# EasyEDA schematic Schematic_IOT_Mertz.json
TITLE: IOT_Mertz; REV: 1.0; Date: 2019-05-08; Sheet: 1/1; Drawn By: reza.tz780210; Company: Mertz
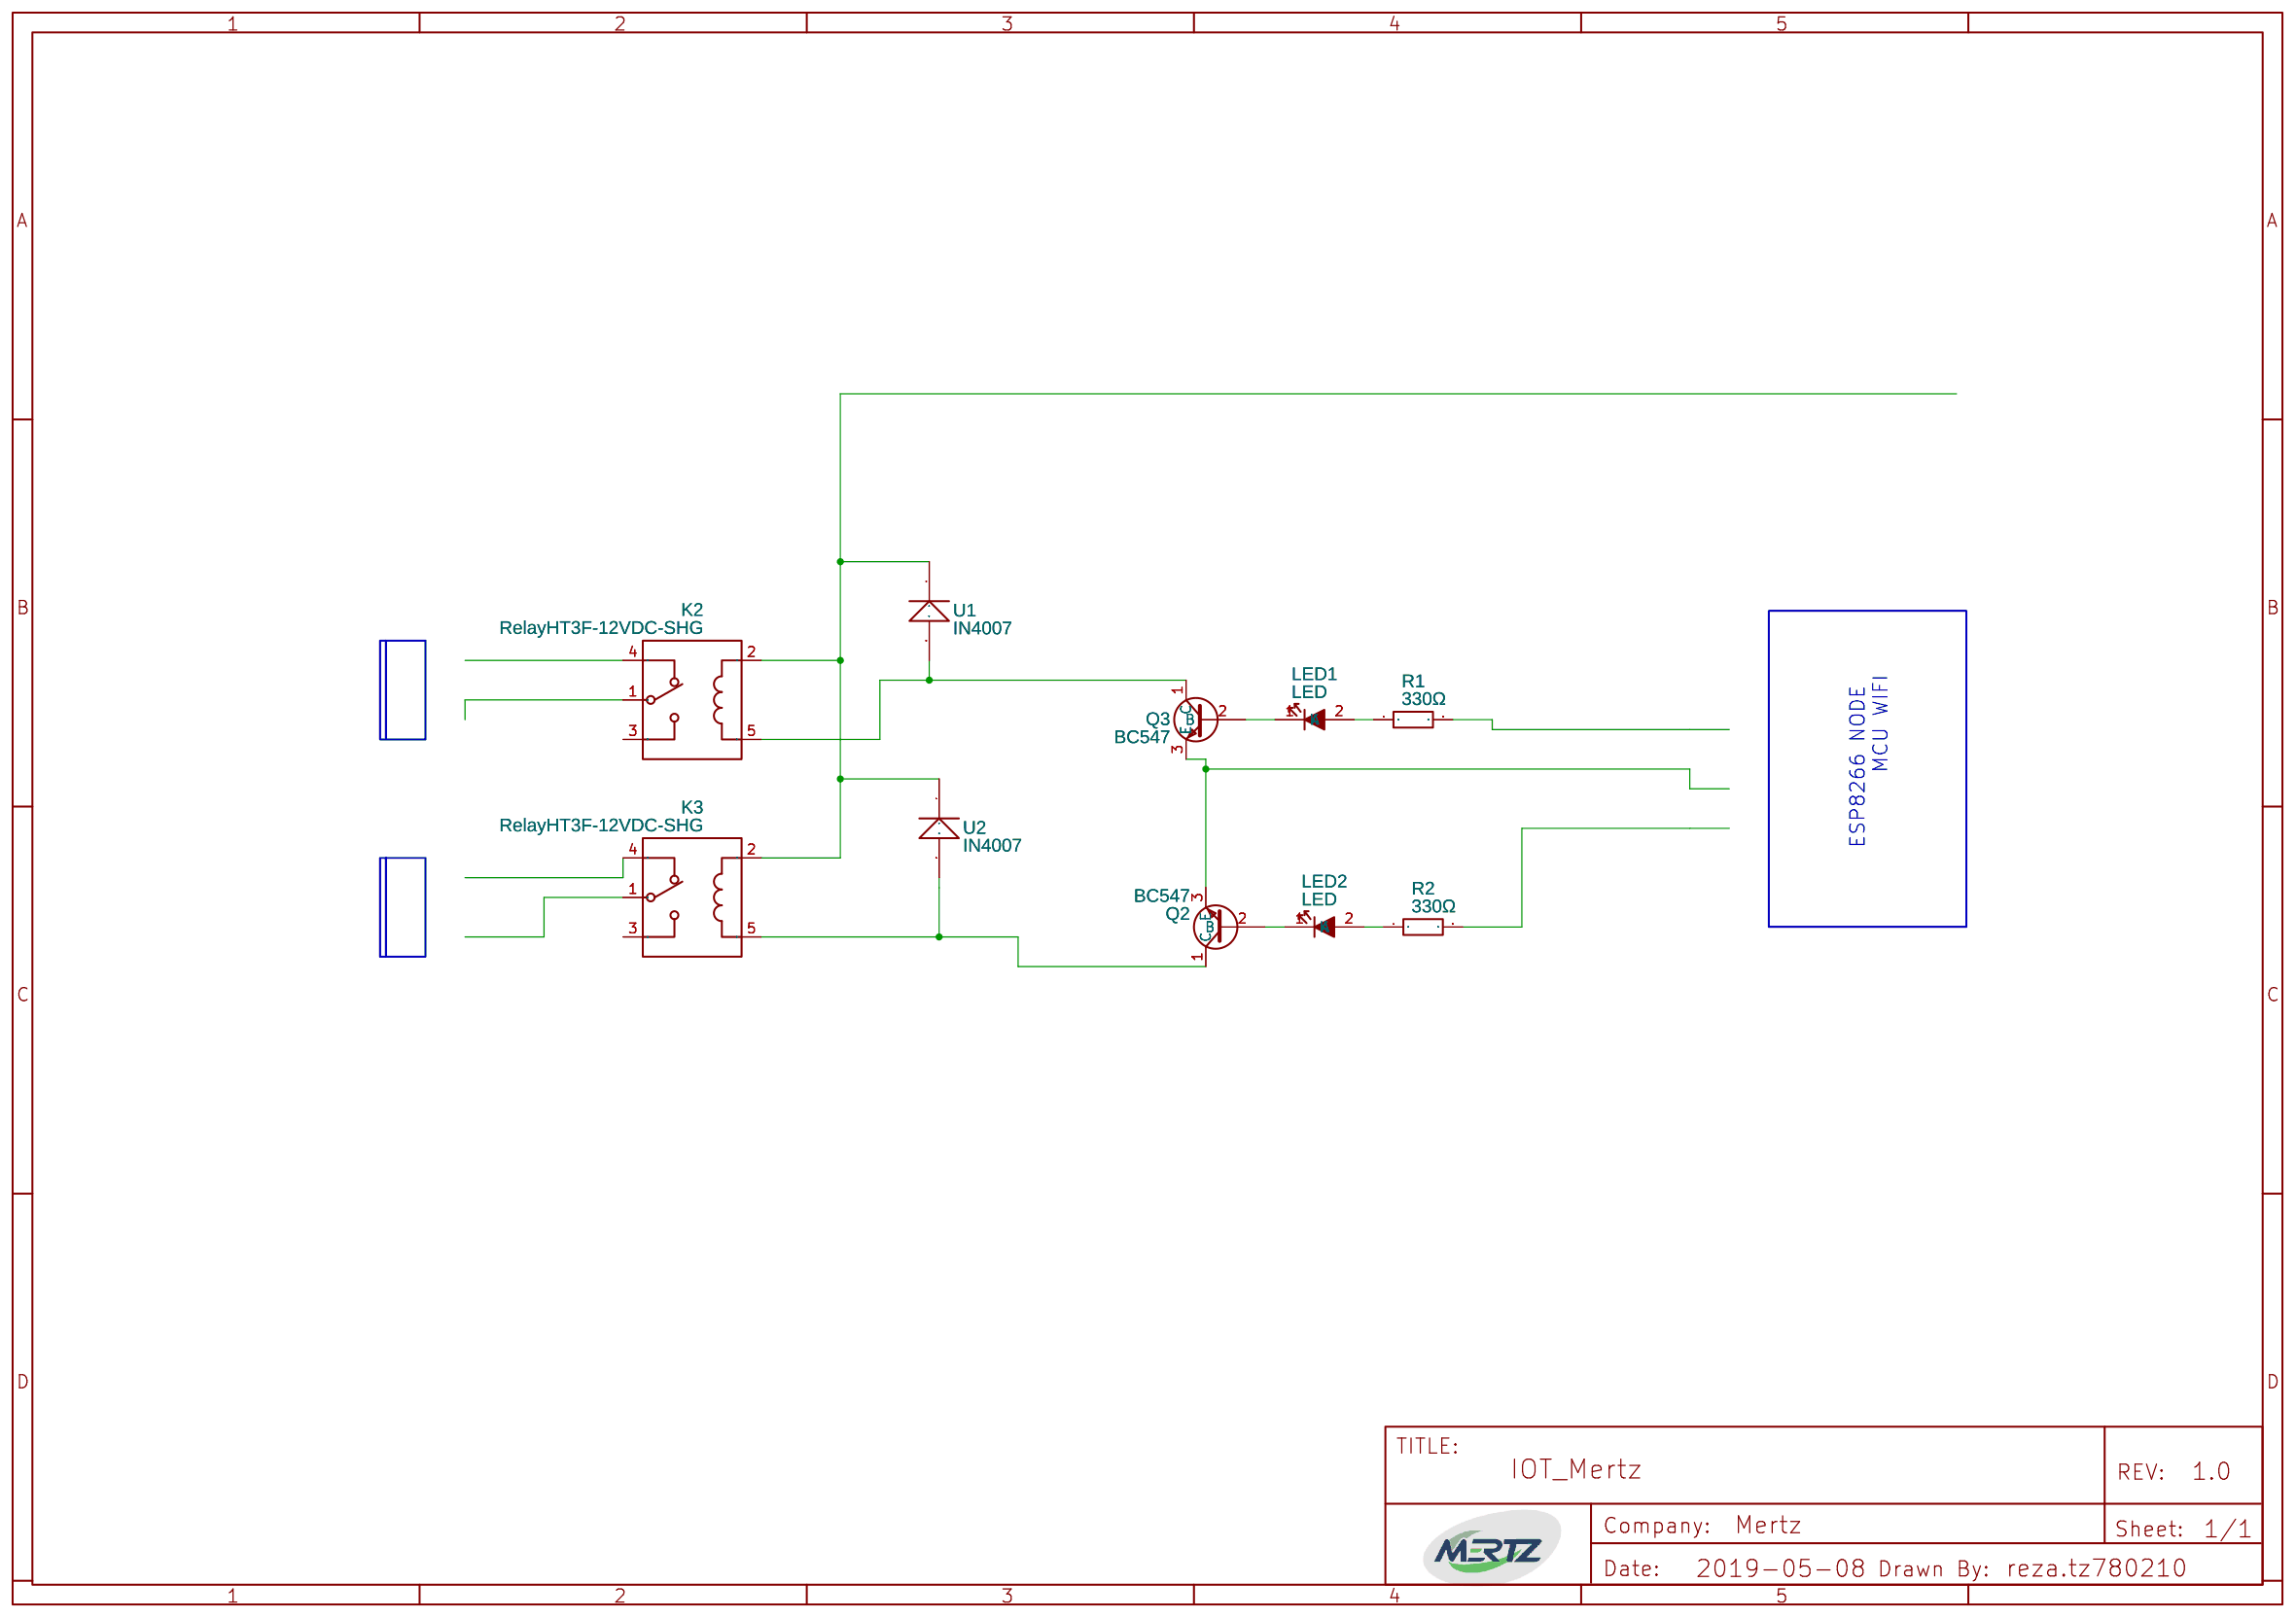
[diagram p0: schematic sheet]

## Parts
K2  RelayHT3F-12VDC-SHG  [RELAY-TH_5PIN_HT3F-12VDC-SHG]
K3  RelayHT3F-12VDC-SHG  [RELAY-TH_5PIN_HT3F-12VDC-SHG]
LED1  LED  [LED-5.8MM]
LED2  LED  [LED-5.8MM]
Q2  BC547  [TO92]
Q3  BC547  [TO92]
R1  330Ω  [1206]
R2  330Ω  [1206]
U1  IN4007  [DIOD_IN4007]
U2  IN4007  [DIOD_IN4007]

## Library data of the parts
K2 K3 = -: Supplier: LCSC; Manufacturer: HTV; image: //image.lceda.cn/szlcsc/C22022.jpg; Supplier Part: C22022
LED1 LED2 = -: Contributor: mdmeng; Manufacturer Part: ?
Q2 Q3 = -: Manufacturer Part: ?
R1 R2 = -: Power: 1/4W; Tolerance: ±1%; Supplier Part: C17930; Supplier: LCSC; Manufacturer: UniOhm; Manufacturer Part: 1206W4F3300T5E
U1 U2 = -: Contributor: DongWu

## Nets
Net-(K2-2): K2.2 K3.2 U1.1 U2.1
Net-(K2-5): K2.5 Q3.1(C) U1.2
Net-(K3-5): K3.5 Q2.1(C) U2.2
Net-(LED1-1): LED1.1(K) Q3.2(B)
Net-(LED1-2): LED1.2(A) R1.1
Net-(LED2-1): LED2.1(K) Q2.2(B)
Net-(LED2-2): LED2.2(A) R2.1
Net-(Q2-3): Q2.3(E) Q3.3(E)

Not connected (* = marked no-connect by the designer): K2 1 3 4; K3 1 3 4; R1 2; R2 2

## Notes on the sheet
- ESP8266 NODE
  MCU WIFI
